# EAGLE design play (EAGLE 6.5.0)
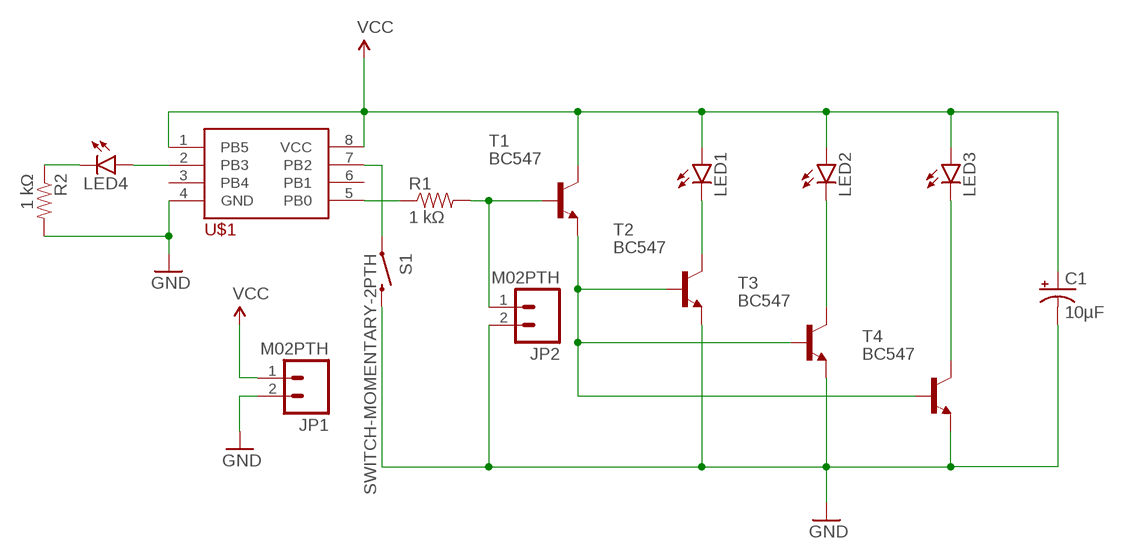
[diagram p0: schematic, sheet 1]

## Parts
C1  10µF  CAP_POLPTH2  [CPOL-RADIAL-10UF-25V]
JP1  M02PTH  [1X02]
JP2  M02PTH  [1X02]
LED1  LED5MM  [LED5MM]
LED2  LED5MM  [LED5MM]
LED3  LED5MM  [LED5MM]
LED4  LED3MM  [LED3MM]
R1  1 kΩ  RESISTORPTH-1/4W  [AXIAL-0.4]
R2  1 kΩ  RESISTORPTH-1/4W  [AXIAL-0.4]
S1  SWITCH-MOMENTARY-2PTH  [TACTILE-PTH]
T1  BC547  [TO92]
T2  BC547  [TO92]
T3  BC547  [TO92]
T4  BC547  [TO92]
U$1  ATTINY85  [DIP8]

## Nets
GND: C1.2(-) JP1.2 JP2.2 R2.P$2 S1.3 T2.1(E) T3.1(E) T4.1(E) U$1.4(GND)
N$1: R1.P$1 U$1.5(PB0)
N$2: JP2.1 R1.P$2 T1.2(B)
N$3: T1.1(E) T2.2(B) T3.2(B) T4.2(B)
N$4: LED1.K(C) T2.3(C)
N$5: S1.1 U$1.7(PB2)
N$6: LED2.K(C) T3.3(C)
N$7: LED3.K(C) T4.3(C)
N$8: LED4.A U$1.2(PB3)
N$9: LED4.K(C) R2.P$1
VCC: C1.1(+) JP1.1 LED1.A LED2.A LED3.A T1.3(C) U$1.1(PB5) U$1.8(VCC)
Unconnected: U$1.3(PB4) U$1.6(PB1)

## Library data of the parts
C1 = SparkFun-Capacitors:CAP_POL: Capacitor Polarized These are standard SMD and PTH capacitors. Normally 10uF, 47uF, and 100uF in electrolytic and tantalum varieties. Always verify the external diameter of the through hole cap, it varies with capacity, voltage, and manufacturer. The EIA devices should be standard.
JP1 JP2 = SparkFun-Connectors:M02: Standard 2-pin 0.1" header. Use with - straight break away headers ( PRT-00116) - right angle break away headers (PRT-00553) - swiss pins (PRT-00743) - machine pins (PRT-00117) - female headers (PRT-00115) Molex polarized connector foot print use with: PRT-08233 with associated crimp pins and housings. 2.54_SCREWTERM for use with PRT-10571. 3.5mm Screw Terminal footprints for PRT-08084 5mm Screw Terminal footprints for use with PRT-08433
LED1-LED4 = SparkFun-LED:LED: LEDs Standard schematic elements and footprints for 5mm, 3mm, 1206, and 0603 sized LEDs. 5mm - Spark Fun Electronics SKU : COM-00529 (and others)
R1 = SparkFun-Resistors:RESISTOR: Resistor Basic schematic elements and footprints for 0603, 1206, and PTH resistors.; RESISTANCE: 1 kΩ
R2 = SparkFun-Passives:RESISTOR: Resistor Basic schematic elements and footprints for 0603, 1206, and PTH resistors.; RESISTANCE: 1 kΩ
S1 = SparkFun-Electromechanical:SWITCH-MOMENTARY-2: Various NO switches- pushbuttons, reed, etc
T1 T2 = transistor-neu-to92:BC547: NPN TRANSISTOR
T3 T4 = transistor:BC547: NPN TRANSISTOR
U$1 = attiny85:ATTINY85

## Board
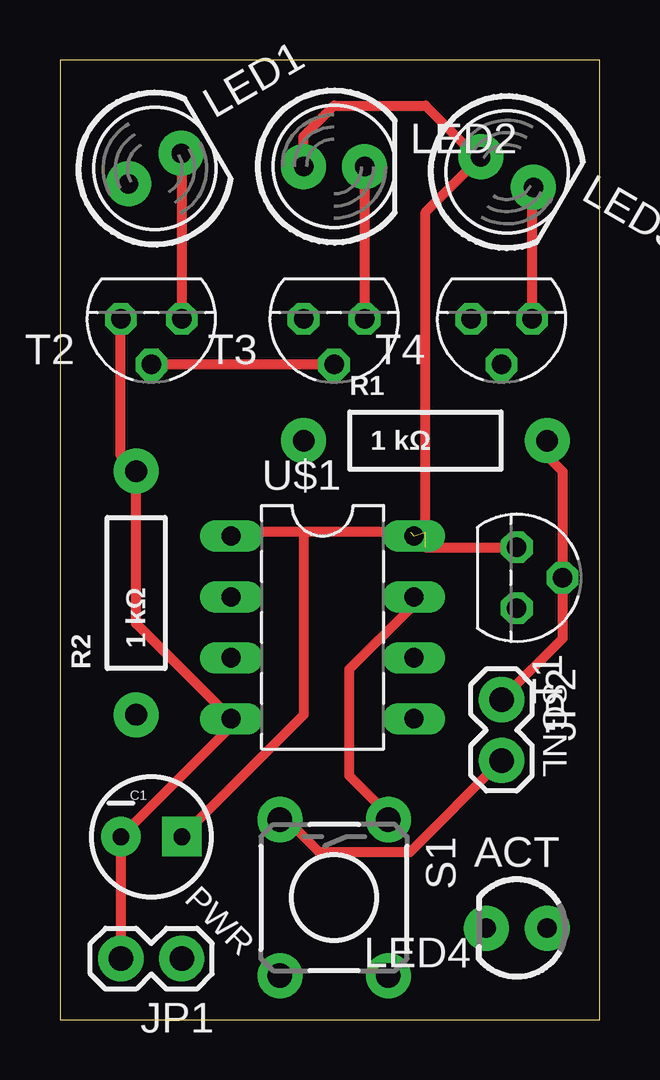
[diagram p1: board, top side]
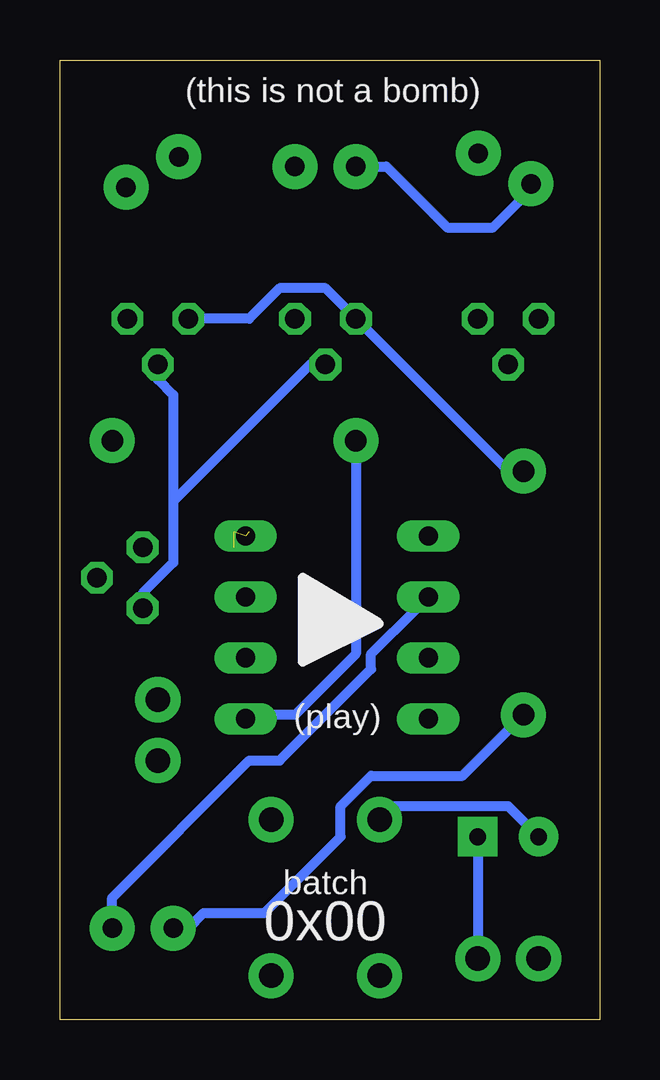
[diagram p2: board, bottom side, seen from below]

Size 22.5 x 40 mm. Coordinates in mm from the lower left corner, seen from the top.
Outline: 0,0 22.5,0 22.5,40 0,40 0,0
Copper layers (1*16): Top 0.035mm / dielectric 1.5mm / Bottom 0.035mm
Design rules "dirt_cheap_dirty_boards.v1 *": minimum track width 16mil, minimum drill 12mil, track to track 5mil, track to pad 5mil, pad to pad 5mil, via to via 5mil, smd to smd 0mil, copper to edge 10mil, drill to drill 10mil, minimum pad ring 10mil, minimum via ring 6mil, stop-mask expansion 2mil, vias tented up to drill 25mil, thermal gap 10mil

### Footprints (pad centres in the part's own frame; a part is rotated, then mirrored left to right if it is on the bottom)
CPOL-RADIAL-10UF-25V = drill 0.7 pad 1.651 square: 1 1.27,0 | drill 0.7 pad 1.651: 2 -1.27,0
1X02 = drill 1.016 pad 1.88: 1 0,0; 2 2.54,0
LED5MM = drill 0.813 pad 1.88: A -1.27,0; K 1.27,0
LED3MM = drill 0.813 pad 1.88: A -1.27,0; K 1.27,0
AXIAL-0.4 = drill 0.9 pad 1.88: P$1 -5.08,0; P$2 5.08,0
TACTILE-PTH = drill 1.016 pad 1.88: 1 -3.251,2.261; 2 3.251,2.261; 3 -3.251,-2.261; 4 3.251,-2.261
TO92 = drill 0.813 octagon: 1 1.27,0; 2 0,1.905; 3 -1.27,0
DIP8 = drill 0.8 long: 1 -3.81,3.81; 2 -3.81,1.27; 3 -3.81,-1.27; 4 -3.81,-3.81; 5 3.81,-3.81; 6 3.81,-1.27; 7 3.81,1.27; 8 3.81,3.81

### Placement (x,y rotation side)
C1  3.81,7.62 0 top
JP1  5.08,2.54 180 top
JP2  18.41,13.34 270 top
LED1  3.96,35.47 30 top
LED2  11.43,35.56 0 top
LED3  18.65,35.33 330 top
LED4  19.05,3.81 180 top
R1  15.24,24.13 0 top
R2  3.17,17.78 90 top
S1  11.43,5.08 270 top
T1  19.05,18.41 270 top
T2  3.81,29.21 180 top
T3  11.43,29.21 180 top
T4  18.41,29.21 180 top
U$1  10.95,16.35 0 top

### Tracks (layer width: path | path; a pad name or v marks a point on that pad's centre or on a via)
GND
  Top 0.406: T2.1 2.54,23.5 R2.P$2 3.17,16.51 6.99,12.7 U$1.4 6.99,12.06 C1.2 JP1.2 | JP2.2 14.61,6.99 10.79,6.99 9.53,8.26 S1.3
  Bottom 0.406: R2.P$2 3.81,22.86 T3.1 11.43,30.48 13.34,30.48 14.61,29.21 T4.1 | C1.2 3.81,8.89 8.89,8.89 S1.3
N$1
  Bottom 0.406: R1.P$1 10.16,15.24 12.7,12.7 14.61,12.7 U$1.5
N$2
  Top 0.406: R1.P$2 20.32,23.5 20.95,22.86 T1.2 20.95,15.88 JP2.1
N$3
  Top 0.406: T3.2 T2.2
  Bottom 0.406: T1.1 19.05,17.78 17.78,19.05 17.78,21.59 | 17.78,21.59 17.78,26.04 18.41,26.67 T4.2 | T3.2 12.06,27.3 17.78,21.59
N$4
  Top 0.406: T2.3 5.08,35.56 LED1.K
N$5
  Top 0.406: U$1.7 14.61,17.14 12.06,14.61 12.06,10.16 13.34,8.89 S1.1
N$6
  Top 0.406: LED2.K T3.3
N$7
  Top 0.406: T4.3 19.68,34.29 LED3.K
N$8
  Bottom 0.406: LED4.A 20.32,5.08 14.61,10.79 13.34,10.79 9.53,14.61 9.53,15.24 7.62,17.14 U$1.2
N$9
  Bottom 0.406: R2.P$1 5.71,10.16 9.53,10.16 10.79,8.89 10.79,7.62 13.97,4.45 16.51,4.45 17.14,3.81 LED4.K
VCC  (3 unrouted)
  Top 0.406: LED2.A 10.16,36.83 11.43,38.1 15.24,38.1 17.14,36.2 LED3.A 15.24,33.66 15.24,20.32 | 14.61,20.32 10.16,20.32 | 10.16,20.32 7.62,20.32 U$1.1 | 15.24,19.68 T1.3 | C1.1 10.16,12.7 10.16,20.32
  Bottom 0.406: LED2.A 8.89,35.56 6.35,33.02 4.45,33.02 3.17,34.29 LED1.A | C1.1 JP1.1

### Text on the board
_tsilk: SGNL | ACT | PWR
_bsilk: (this is not a bomb) | (play) | batch | 0x00